# Altium schematic sheet DepthSensor.SchDoc
size A; SheetNumber: 4D; SheetTotal: 4D
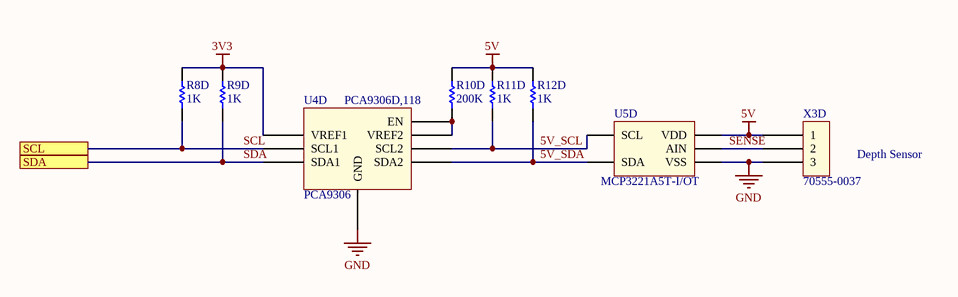
[diagram p0: DepthSensor.SchDoc]

## Parts
R8D  1K  [RESC1206(3216)_N]
R9D  1K  [RESC1206(3216)_N]
R10D  200K  [RESC1206(3216)_M]
R11D  1K  [RESC1206(3216)_N]
R12D  1K  [RESC1206(3216)_N]
U4D  PCA9306  Manufacturer Part Number: PCA9306D,118  [PCA9306-SO8]
U5D  Manufacturer Part Number: MCP3221A5T-I/OT  [MCP3221-SOT23-5]
X3D  70555-0037  [70555-0037]

## Ports
SCL, SDA

## Nets
3V3: R8D.2 R9D.2 U4D.VREF1
5V: R10D.2 R11D.2 R12D.2 U5D.VDD X3D.1
GND: U4D.GND U5D.VSS X3D.3
5V_SCL: R11D.1 U4D.SCL2 U5D.SCL
5V_SDA: R12D.1 U4D.SDA2 U5D.SDA
SCL: R8D.1 U4D.SCL1 ; port SCL
SDA: R9D.1 U4D.SDA1 ; port SDA
SENSE: U5D.AIN X3D.2
NetR10D_1: R10D.1 U4D.EN U4D.VREF2

## Notes on the sheet
- Depth Sensor
- Title
- Size:
- Date:
- A
- Number:
- Time:
- Revision:
- Sheet
- of
- File:

## Library data of the parts
R8D R9D R11D R12D = CMP-1014-00510-1: 1K 0.25W 1% 1206 (3216 Metric)  SMD; Case-Metric: 3216; Case-EIA: 1206; Value: 1000.00 Ohm; Power: 0.25 W; Tolerance: 1 %; Technology: SMT
R10D = CMP-1014-00768-1: 200K 0.25W 1% 1206 (3216 Metric)  SMD; Case-EIA: 1206; Value: 200000.00 Ohm; Case-Metric: 3216; Power: 0.25 W; Technology: SMT; Tolerance: 1 %
U4D = PCA9306: PCA9306, Bidirectional level translator; Manufacturer: NXP; IC Interface Type: I2; Supply Voltage Min: 1; Supply Voltage Max: 3.6; Interface Case Style: SOIC; No. of Pins: 8; Supplier 1: Newark; Supplier Part Number 1: 70R6428; RoHS: YES; Stock 1: 3293; Pricing 1: 1=0.346, 10=0.346, 25=0.346, 100=0.346, 250=0.317, 500=0.317, 1000=0.293, 2500=0.272 (USD); Interface Applications: -; Operating Temperature Min: -40 C; Packaging: Cut Tape; ComponentLink1URL: http://www.nxp.com/packings/SOT96-1_118.html; ComponentLink1Description: http://www.nxp.com/packings/SOT96-1_118.html; ComponentLink2URL: http://www.farnell.com/cad/1549203.zip; ComponentLink2Description: http://www.farnell.com/cad/1549203.zip; ComponentLink3URL: http://www.farnell.com/datasheets/1805226.pdf; ComponentLink3Description: http://www.farnell.com/datasheets/1805226.pdf
U5D = MCP3221: MCP3221, 12 bit ADC, I2C; Manufacturer: MICROCHIP; Resolution (Bits): 12; Sampling Rate: 22.3; Supply Voltage Type: Single; Supply Voltage Min: 2.7; Supply Voltage Max: 5.5; ADC / DAC Case Style: SOT-23; No. of Pins: 5; Supplier 1: Newark; Supplier Part Number 1: 92C2410; RoHS: YES; Stock 1: 2165; Pricing 1: 1=1.44, 26=1.2, 100=1.09 (USD); ComponentLink1URL: http://www.farnell.com/cad/1545531.zip; ComponentLink1Description: http://www.farnell.com/cad/1545531.zip; ComponentLink2URL: http://www.farnell.com/datasheets/12186.pdf; ComponentLink2Description: http://www.farnell.com/datasheets/12186.pdf
X3D = 70555-0037: Molex, C-Grid SL 70555, 3 Pin; Product Range: SL 70555 Series; Contact Termination Type: Through Hole; Gender: Header; No. of Contacts: 3; Pitch Spacing: 2.54; No. of Rows: 1; Supplier 1: Newark; Supplier Part Number 1: 59H2958; Manufacturer: MOLEX; RoHS: YES; Stock 1: 1580; Pricing 1: 1=0.679, 10=0.622, 100=0.575, 500=0.575, 1000=0.534, 2000=0.495, 5000=0.484, 10000=0.47 (USD); Contact Plating: Gold Plated Contacts; ComponentLink1URL: http://www.farnell.com/cad/1737917.pdf; ComponentLink1Description: http://www.farnell.com/cad/1737917.pdf; ComponentLink2URL: http://www.farnell.com/datasheets/1947503.pdf; ComponentLink2Description: http://www.farnell.com/datasheets/1947503.pdf; ComponentLink3URL: http://www.farnell.com/cad/1980011.zip; ComponentLink3Description: http://www.farnell.com/cad/1980011.zip